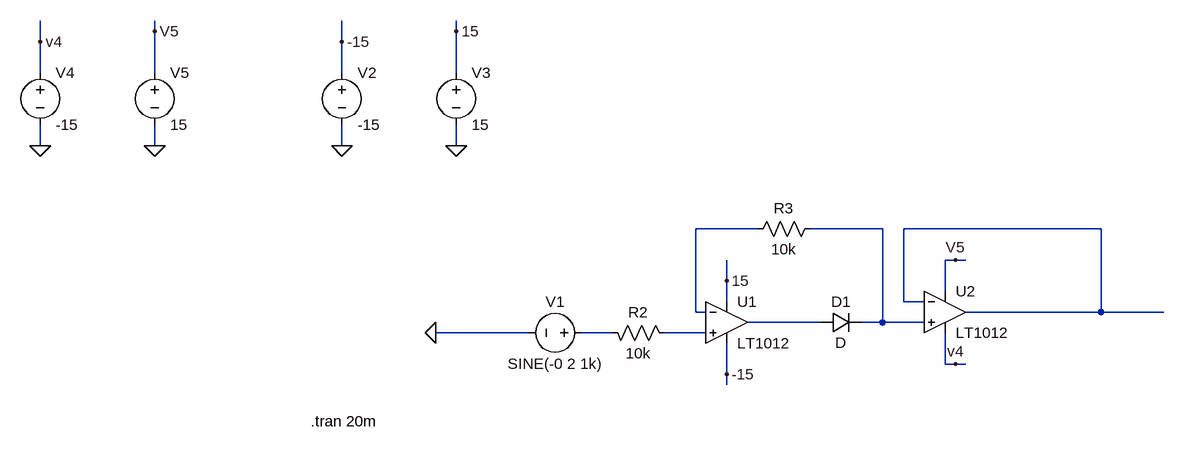
[diagram p0: schematic LaboS5.2.2.asc]
LaboS5.2.2.asc, the LTspice schematic file:
Version 4
SHEET 1 880 680
WIRE -1088 -304 -1088 -320
WIRE -624 -304 -624 -320
WIRE -1264 -288 -1264 -320
WIRE -800 -288 -800 -320
WIRE -1264 -240 -1264 -288
WIRE -1088 -240 -1088 -304
WIRE -800 -240 -800 -288
WIRE -624 -240 -624 -304
WIRE -1264 -128 -1264 -160
WIRE -1088 -128 -1088 -160
WIRE -800 -128 -800 -160
WIRE -624 -128 -624 -160
WIRE -160 0 -256 0
WIRE 32 0 -80 0
WIRE 368 0 64 0
WIRE 144 48 128 48
WIRE 160 48 144 48
WIRE -208 80 -208 48
WIRE 128 96 128 48
WIRE -208 112 -208 80
WIRE 64 112 64 0
WIRE 96 112 64 112
WIRE -256 128 -256 0
WIRE -240 128 -256 128
WIRE 368 128 368 0
WIRE 368 128 160 128
WIRE 464 128 368 128
WIRE -64 144 -176 144
WIRE 32 144 32 0
WIRE 32 144 0 144
WIRE 96 144 32 144
WIRE -512 160 -656 160
WIRE -384 160 -432 160
WIRE -240 160 -304 160
WIRE 128 208 128 160
WIRE 144 208 128 208
WIRE 160 208 144 208
WIRE -208 224 -208 176
WIRE -208 240 -208 224
FLAG -656 160 0
FLAG -800 -128 0
FLAG -624 -128 0
FLAG -624 -304 15
FLAG -800 -288 -15
FLAG -208 80 15
FLAG -208 224 -15
FLAG -1264 -128 0
FLAG -1088 -128 0
FLAG -1088 -304 V5
FLAG -1264 -288 v4
FLAG 144 48 V5
FLAG 144 208 v4
SYMBOL voltage -416 160 R90
WINDOW 0 -32 56 VBottom 2
WINDOW 3 32 56 VTop 2
WINDOW 123 0 0 Left 2
WINDOW 39 0 0 Left 2
SYMATTR InstName V1
SYMATTR Value SINE(-0 2 1k)
SYMBOL Opamps\\LT1012 -208 80 R0
SYMATTR InstName U1
SYMBOL diode -64 128 M90
WINDOW 0 0 32 VBottom 2
WINDOW 3 32 32 VTop 2
SYMATTR InstName D1
SYMBOL voltage -800 -256 R0
WINDOW 123 0 0 Left 2
WINDOW 39 0 0 Left 2
SYMATTR InstName V2
SYMATTR Value -15
SYMBOL voltage -624 -256 R0
WINDOW 123 0 0 Left 2
WINDOW 39 0 0 Left 2
SYMATTR InstName V3
SYMATTR Value 15
SYMBOL res -400 144 M90
WINDOW 0 0 56 VBottom 2
WINDOW 3 32 56 VTop 2
SYMATTR InstName R2
SYMATTR Value 10k
SYMBOL res -64 -16 R90
WINDOW 0 0 56 VBottom 2
WINDOW 3 32 56 VTop 2
SYMATTR InstName R3
SYMATTR Value 10k
SYMBOL Opamps\\LT1012 128 64 R0
SYMATTR InstName U2
SYMBOL voltage -1264 -256 R0
WINDOW 123 0 0 Left 2
WINDOW 39 0 0 Left 2
SYMATTR InstName V4
SYMATTR Value -15
SYMBOL voltage -1088 -256 R0
WINDOW 123 0 0 Left 2
WINDOW 39 0 0 Left 2
SYMATTR InstName V5
SYMATTR Value 15
TEXT -848 296 Left 2 !.tran 20m

The netlist it stands for:
* LaboS5.2.2.asc
V1 N005 0 SINE(-0 2 1k)
XU1 N006 N001 15 -15 N004 LT1012  ; pins In+ In- V+ V- OUT
D1 N004 N002 D
V2 -15 0 -15
V3 15 0 15
R2 N005 N006 10k
R3 N002 N001 10k
XU2 N002 N003 V5 v4 N003 LT1012  ; pins In+ In- V+ V- OUT
V4 v4 0 -15
V5 V5 0 15
.model D D
.lib standard.dio
.tran 20m
.backanno
.end